# Altium schematic sheet FrequenzSelect.SchDoc
size A4
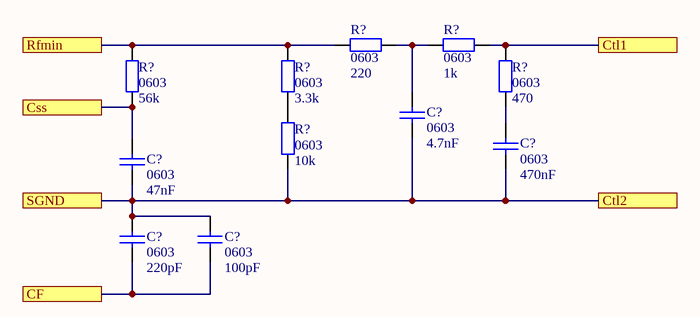
[diagram p0: FrequenzSelect.SchDoc]

## Parts
(Parts that share a designator on the sheet are numbered #1, #2 ... from top to bottom, then left to right.)
C?#1  0603  value 4.7nF  [1608[0603]]
C?#2  0603  value 470nF  [1608[0603]]
C?#3  0603  value 47nF  [1608[0603]]
C?#4  0603  value 220pF  [1608[0603]]
C?#5  0603  value 100pF  [1608[0603]]
R?#1  0603  value 56k  [1608[0603]]
R?#2  0603  value 3.3k  [1608[0603]]
R?#3  0603  value 220  [1608[0603]]
R?#4  0603  value 1k  [1608[0603]]
R?#5  0603  value 470  [1608[0603]]
R?#6  0603  value 10k  [1608[0603]]

## Ports
CF, Css, Ctl1, Ctl2, Rfmin, SGND

## Nets
CF: C?#4.1 C?#5.1 ; port CF
Css: C?#3.2 R?#1.2 ; port Css
Ctl1: R?#4.2 R?#5.2 ; port Ctl1
Ctl2: C?#1.1 C?#2.1 C?#3.1 C?#4.2 C?#5.2 R?#6.2 ; port Ctl2, port SGND
Rfmin: R?#1.1 R?#2.1 R?#3.1 ; port Rfmin
NetC?#1_2: C?#1.2 R?#3.2 R?#4.1
NetC?#2_2: C?#2.2 R?#5.1
NetR?#2_2: R?#2.2 R?#6.1

## Library data of the parts
C?#1-C?#5 = Cap: Capacitor; Published: 8-Jun-2000; LatestRevisionDate: 17-Jul-2002; LatestRevisionNote: Re-released for DXP Platform.; PackageReference: RAD-0.3; Publisher: Altium Limited; PackageDescription: Radial Cap, Thru-Hole; 2 Leads; 0.3 in Pin Spacing; Supplier 1: Digi-Key; Supplier Part Number 1: ECQ-U2A224KL-ND
R?#1-R?#6 = Res2: Resistor; Published: 8-Jun-2000; LatestRevisionDate: 17-Jul-2002; LatestRevisionNote: Re-released for DXP Platform.; PackageReference: AXIAL-0.4; Publisher: Altium Limited; PackageDescription: Axial Device, Thru-Hole; 2 Leads; 0.4 in Pin Spacing; Supplier 1: Digi-Key; Supplier Part Number 1: 541-220KFDKR-ND